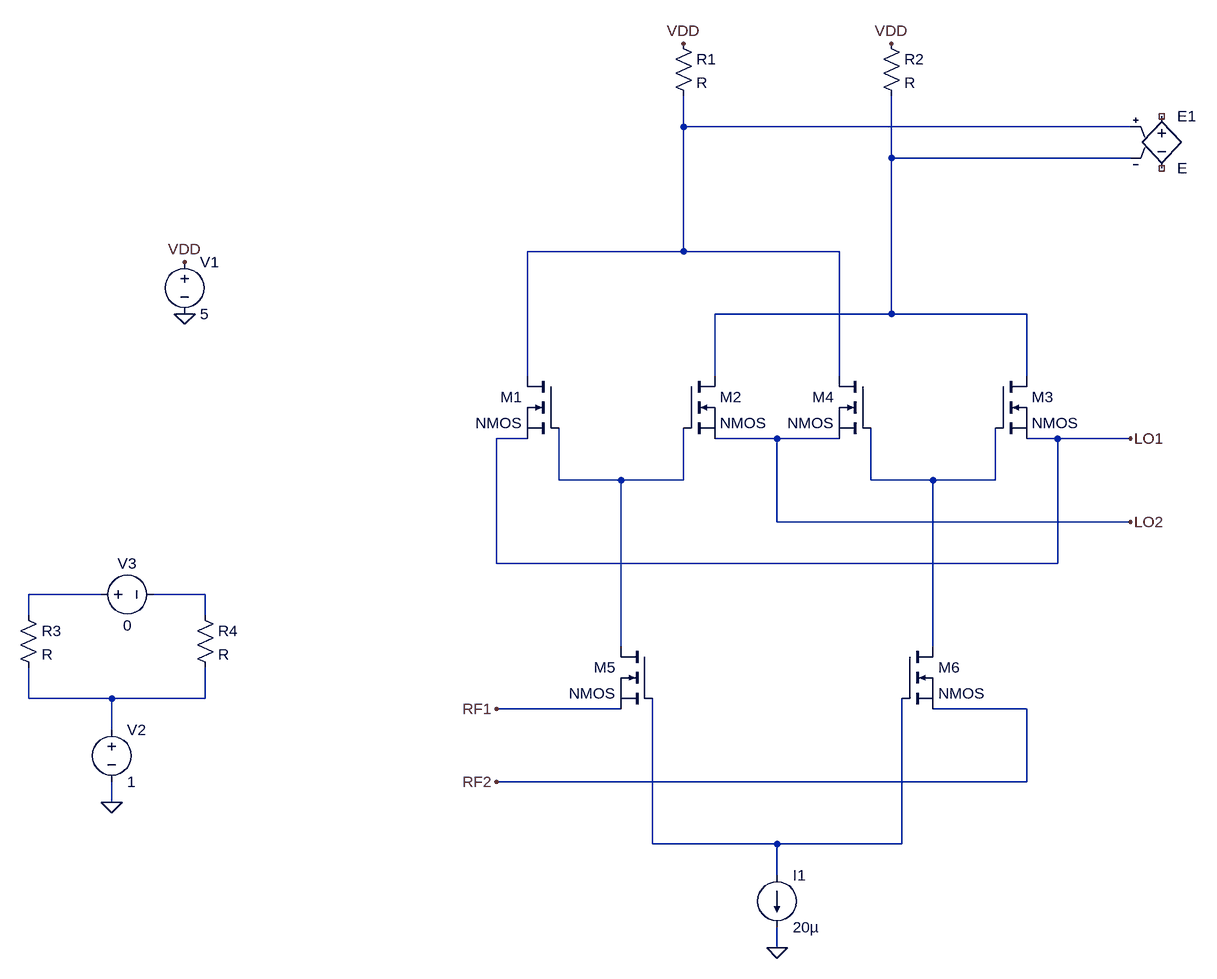
[diagram p0: schematic Gilber_Cell_PFD.asc]
Gilber_Cell_PFD.asc, the LTspice schematic file:
Version 4
SHEET 1 1208 996
WIRE 416 -288 416 -336
WIRE 1104 -288 416 -288
WIRE 736 -240 736 -336
WIRE 1104 -240 736 -240
WIRE 416 -96 416 -288
WIRE 416 -96 176 -96
WIRE 656 -96 416 -96
WIRE 736 0 736 -240
WIRE 736 0 464 0
WIRE 944 0 736 0
WIRE 176 96 176 -96
WIRE 464 96 464 0
WIRE 656 96 656 -96
WIRE 944 96 944 0
WIRE 176 192 128 192
WIRE 560 192 464 192
WIRE 656 192 560 192
WIRE 992 192 944 192
WIRE 1104 192 992 192
WIRE 224 256 224 176
WIRE 320 256 224 256
WIRE 416 256 416 176
WIRE 416 256 320 256
WIRE 704 256 704 176
WIRE 800 256 704 256
WIRE 896 256 896 176
WIRE 896 256 800 256
WIRE 560 320 560 192
WIRE 1104 320 560 320
WIRE 128 384 128 192
WIRE 992 384 992 192
WIRE 992 384 128 384
WIRE -480 432 -592 432
WIRE -320 432 -400 432
WIRE -592 464 -592 432
WIRE -320 464 -320 432
WIRE 320 512 320 256
WIRE 800 512 800 256
WIRE -592 592 -592 544
WIRE -464 592 -592 592
WIRE -320 592 -320 544
WIRE -320 592 -464 592
WIRE 320 608 128 608
WIRE 944 608 800 608
WIRE -464 640 -464 592
WIRE 944 720 944 608
WIRE 944 720 128 720
WIRE -464 752 -464 720
WIRE 368 816 368 592
WIRE 560 816 368 816
WIRE 752 816 752 592
WIRE 752 816 560 816
WIRE 560 864 560 816
WIRE 560 976 560 944
FLAG -352 -80 VDD
FLAG -352 0 0
FLAG 560 976 0
FLAG 416 -416 VDD
FLAG 736 -416 VDD
FLAG 128 608 RF1
FLAG 128 720 RF2
FLAG 1104 192 LO1
FLAG 1104 320 LO2
FLAG -464 752 0
SYMBOL voltage -352 -96 R0
WINDOW 123 0 0 Left 0
WINDOW 39 0 0 Left 0
SYMATTR InstName V1
SYMATTR Value 5
SYMBOL nmos 416 96 R0
SYMATTR InstName M2
SYMBOL nmos 224 96 M0
SYMATTR InstName M1
SYMBOL nmos 896 96 R0
SYMATTR InstName M3
SYMBOL nmos 704 96 M0
SYMATTR InstName M4
SYMBOL nmos 368 512 M0
SYMATTR InstName M5
SYMBOL nmos 752 512 R0
SYMATTR InstName M6
SYMBOL current 560 864 R0
WINDOW 123 0 0 Left 0
WINDOW 39 0 0 Left 0
SYMATTR InstName I1
SYMATTR Value 20µ
SYMBOL res 400 -432 R0
SYMATTR InstName R1
SYMBOL res 720 -432 R0
SYMATTR InstName R2
SYMBOL e 1152 -320 R0
SYMATTR InstName E1
SYMBOL res -608 448 R0
SYMATTR InstName R3
SYMBOL res -336 448 R0
SYMATTR InstName R4
SYMBOL voltage -464 624 R0
WINDOW 123 0 0 Left 0
WINDOW 39 0 0 Left 0
SYMATTR InstName V2
SYMATTR Value 1
SYMBOL voltage -496 432 R270
WINDOW 0 32 56 VTop 2
WINDOW 3 -32 56 VBottom 2
WINDOW 123 0 0 Left 0
WINDOW 39 0 0 Left 0
SYMATTR InstName V3
SYMATTR Value 0

The netlist it stands for:
* Gilber_Cell_PFD.asc
V1 VDD 0 5
M2 N002 N003 LO2 LO2 NMOS
M1 N001 N003 LO1 LO1 NMOS
M3 N002 N004 LO1 LO1 NMOS
M4 N001 N004 LO2 LO2 NMOS
M5 N003 N008 RF1 RF1 NMOS
M6 N004 N008 RF2 RF2 NMOS
I1 N008 0 20µ
R1 VDD N001 R
R2 VDD N002 R
E1 NC_01 NC_02 N001 N002 E
R3 N005 N007 R
R4 N006 N007 R
V2 N007 0 1
V3 N005 N006 0
.model NMOS NMOS
.model PMOS PMOS
.lib standard.mos
.backanno
.end